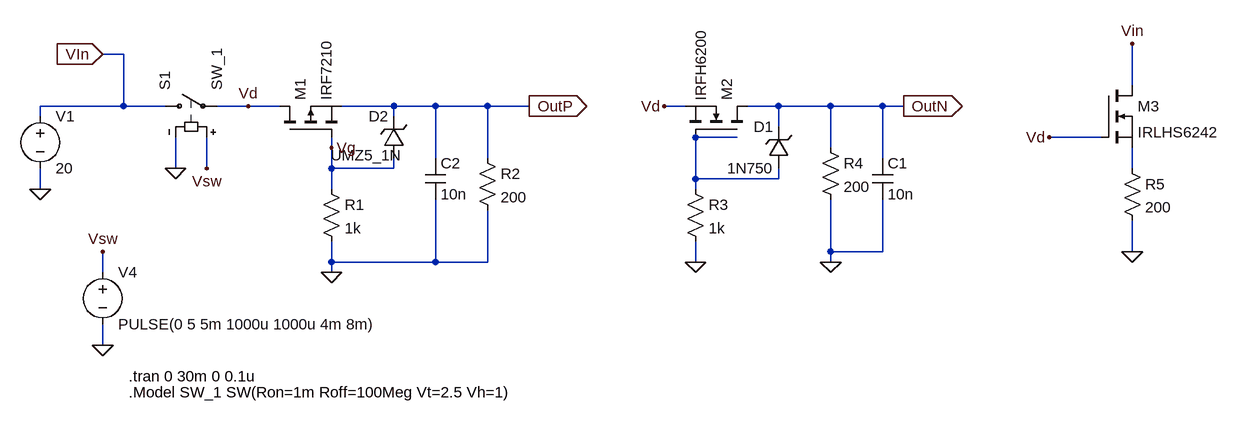
[diagram p0: schematic latching_on_off_MOSFET_switch.asc]
latching_on_off_MOSFET_switch.asc, the LTspice schematic file:
Version 4
SHEET 1 1936 848
WIRE 240 -16 208 -16
WIRE 1792 32 1792 -32
WIRE 240 64 240 -16
WIRE 240 64 112 64
WIRE 304 64 240 64
WIRE 432 64 384 64
WIRE 480 64 432 64
WIRE 656 64 576 64
WIRE 720 64 656 64
WIRE 800 64 720 64
WIRE 864 64 800 64
WIRE 1104 64 1072 64
WIRE 1248 64 1200 64
WIRE 1328 64 1248 64
WIRE 1408 64 1328 64
WIRE 1440 64 1408 64
WIRE 112 80 112 64
WIRE 656 80 656 64
WIRE 1248 96 1248 64
WIRE 1184 112 1120 112
WIRE 1744 112 1664 112
WIRE 560 128 560 112
WIRE 1328 128 1328 64
WIRE 720 144 720 64
WIRE 800 144 800 64
WIRE 1408 144 1408 64
WIRE 320 160 320 112
WIRE 368 160 368 112
WIRE 560 160 560 128
WIRE 656 160 656 144
WIRE 656 160 560 160
WIRE 1792 160 1792 128
WIRE 1120 176 1120 112
WIRE 1248 176 1248 160
WIRE 1248 176 1120 176
WIRE 112 192 112 160
WIRE 560 192 560 160
WIRE 1120 192 1120 176
WIRE 1328 288 1328 208
WIRE 1408 288 1408 208
WIRE 1408 288 1328 288
WIRE 1792 288 1792 240
WIRE 560 304 560 272
WIRE 720 304 720 208
WIRE 720 304 560 304
WIRE 800 304 800 224
WIRE 800 304 720 304
WIRE 1120 304 1120 272
WIRE 1328 304 1328 288
WIRE 208 320 208 288
WIRE 560 320 560 304
WIRE 208 432 208 400
FLAG 112 192 0
FLAG 864 64 OutP
IOPIN 864 64 Out
FLAG 208 -16 VIn
IOPIN 208 -16 In
FLAG 208 432 0
FLAG 208 288 Vsw
FLAG 320 160 0
FLAG 368 160 Vsw
FLAG 560 320 0
FLAG 560 128 Vg
FLAG 432 64 Vd
FLAG 1120 304 0
FLAG 1328 304 0
FLAG 1440 64 OutN
IOPIN 1440 64 Out
FLAG 1072 64 Vd
FLAG 1664 112 Vd
FLAG 1792 288 0
FLAG 1792 -32 Vin
SYMBOL pmos 480 112 R270
SYMATTR InstName M1
SYMATTR Value IRF7210
SYMBOL voltage 112 64 R0
WINDOW 123 0 0 Left 0
WINDOW 39 0 0 Left 0
SYMATTR InstName V1
SYMATTR Value 20
SYMBOL voltage 208 304 R0
WINDOW 123 0 0 Left 0
WINDOW 39 0 0 Left 0
SYMATTR InstName V4
SYMATTR Value PULSE(0 5 5m 1000u 1000u 4m 8m)
SYMBOL sw 288 64 R270
SYMATTR InstName S1
SYMATTR Value SW_1
SYMBOL res 784 128 R0
SYMATTR InstName R2
SYMATTR Value 200
SYMBOL res 544 176 R0
SYMATTR InstName R1
SYMATTR Value 1k
SYMBOL nmos 1200 112 M270
SYMATTR InstName M2
SYMATTR Value IRFH6200
SYMBOL res 1104 176 R0
SYMATTR InstName R3
SYMATTR Value 1k
SYMBOL res 1312 112 R0
SYMATTR InstName R4
SYMATTR Value 200
SYMBOL zener 1264 160 R180
WINDOW 0 24 64 Left 2
WINDOW 3 24 0 Left 2
SYMATTR InstName D1
SYMATTR Value 1N750
SYMATTR Description Diode
SYMATTR Type diode
SYMBOL cap 1392 144 R0
SYMATTR InstName C1
SYMATTR Value 10n
SYMBOL cap 704 144 R0
SYMATTR InstName C2
SYMATTR Value 10n
SYMBOL zener 672 144 R180
WINDOW 0 24 64 Left 2
WINDOW 3 3 4 Left 2
SYMATTR InstName D2
SYMATTR Value UMZ5_1N
SYMATTR Description Diode
SYMATTR Type diode
SYMBOL nmos 1744 32 R0
SYMATTR InstName M3
SYMATTR Value IRLHS6242
SYMBOL res 1776 144 R0
SYMATTR InstName R5
SYMATTR Value 200
TEXT 248 480 Left 2 !.tran 0 30m 0 0.1u
TEXT 248 504 Left 2 !.Model SW_1 SW(Ron=1m Roff=100Meg Vt=2.5 Vh=1)

The netlist it stands for:
* latching_on_off_MOSFET_switch.asc
M1 Vd Vg OutP OutP IRF7210
V1 VIn 0 20
V4 Vsw 0 PULSE(0 5 5m 1000u 1000u 4m 8m)
S1 VIn Vd Vsw 0 SW_1
R2 OutP 0 200
R1 Vg 0 1k
M2 OutN N001 Vd Vd IRFH6200
R3 N001 0 1k
R4 OutN 0 200
D1 N001 OutN 1N750
C1 OutN 0 10n
C2 OutP 0 10n
D2 Vg OutP UMZ5_1N
M3 VIn Vd N002 N002 IRLHS6242
R5 N002 0 200
.model D D
.lib standard.dio
.model NMOS NMOS
.model PMOS PMOS
.lib standard.mos
.tran 0 30m 0 0.1u
.Model SW_1 SW(Ron=1m Roff=100Meg Vt=2.5 Vh=1)
.backanno
.end